# Altium schematic sheet SH6 - LOAD MONITORING 2.SchDoc: Load Monitoring 2
size B; DrawnBy: Farris Matar; Engineer: Farris Matar; Organization: UW Robotics; Address1: 200 University Avenue; Address2: Waterloo; Address3: Ontario; Address4: Canada N2L 3G6; DocumentNumber: 6; Revision: 3; SheetNumber: 6; SheetTotal: 9
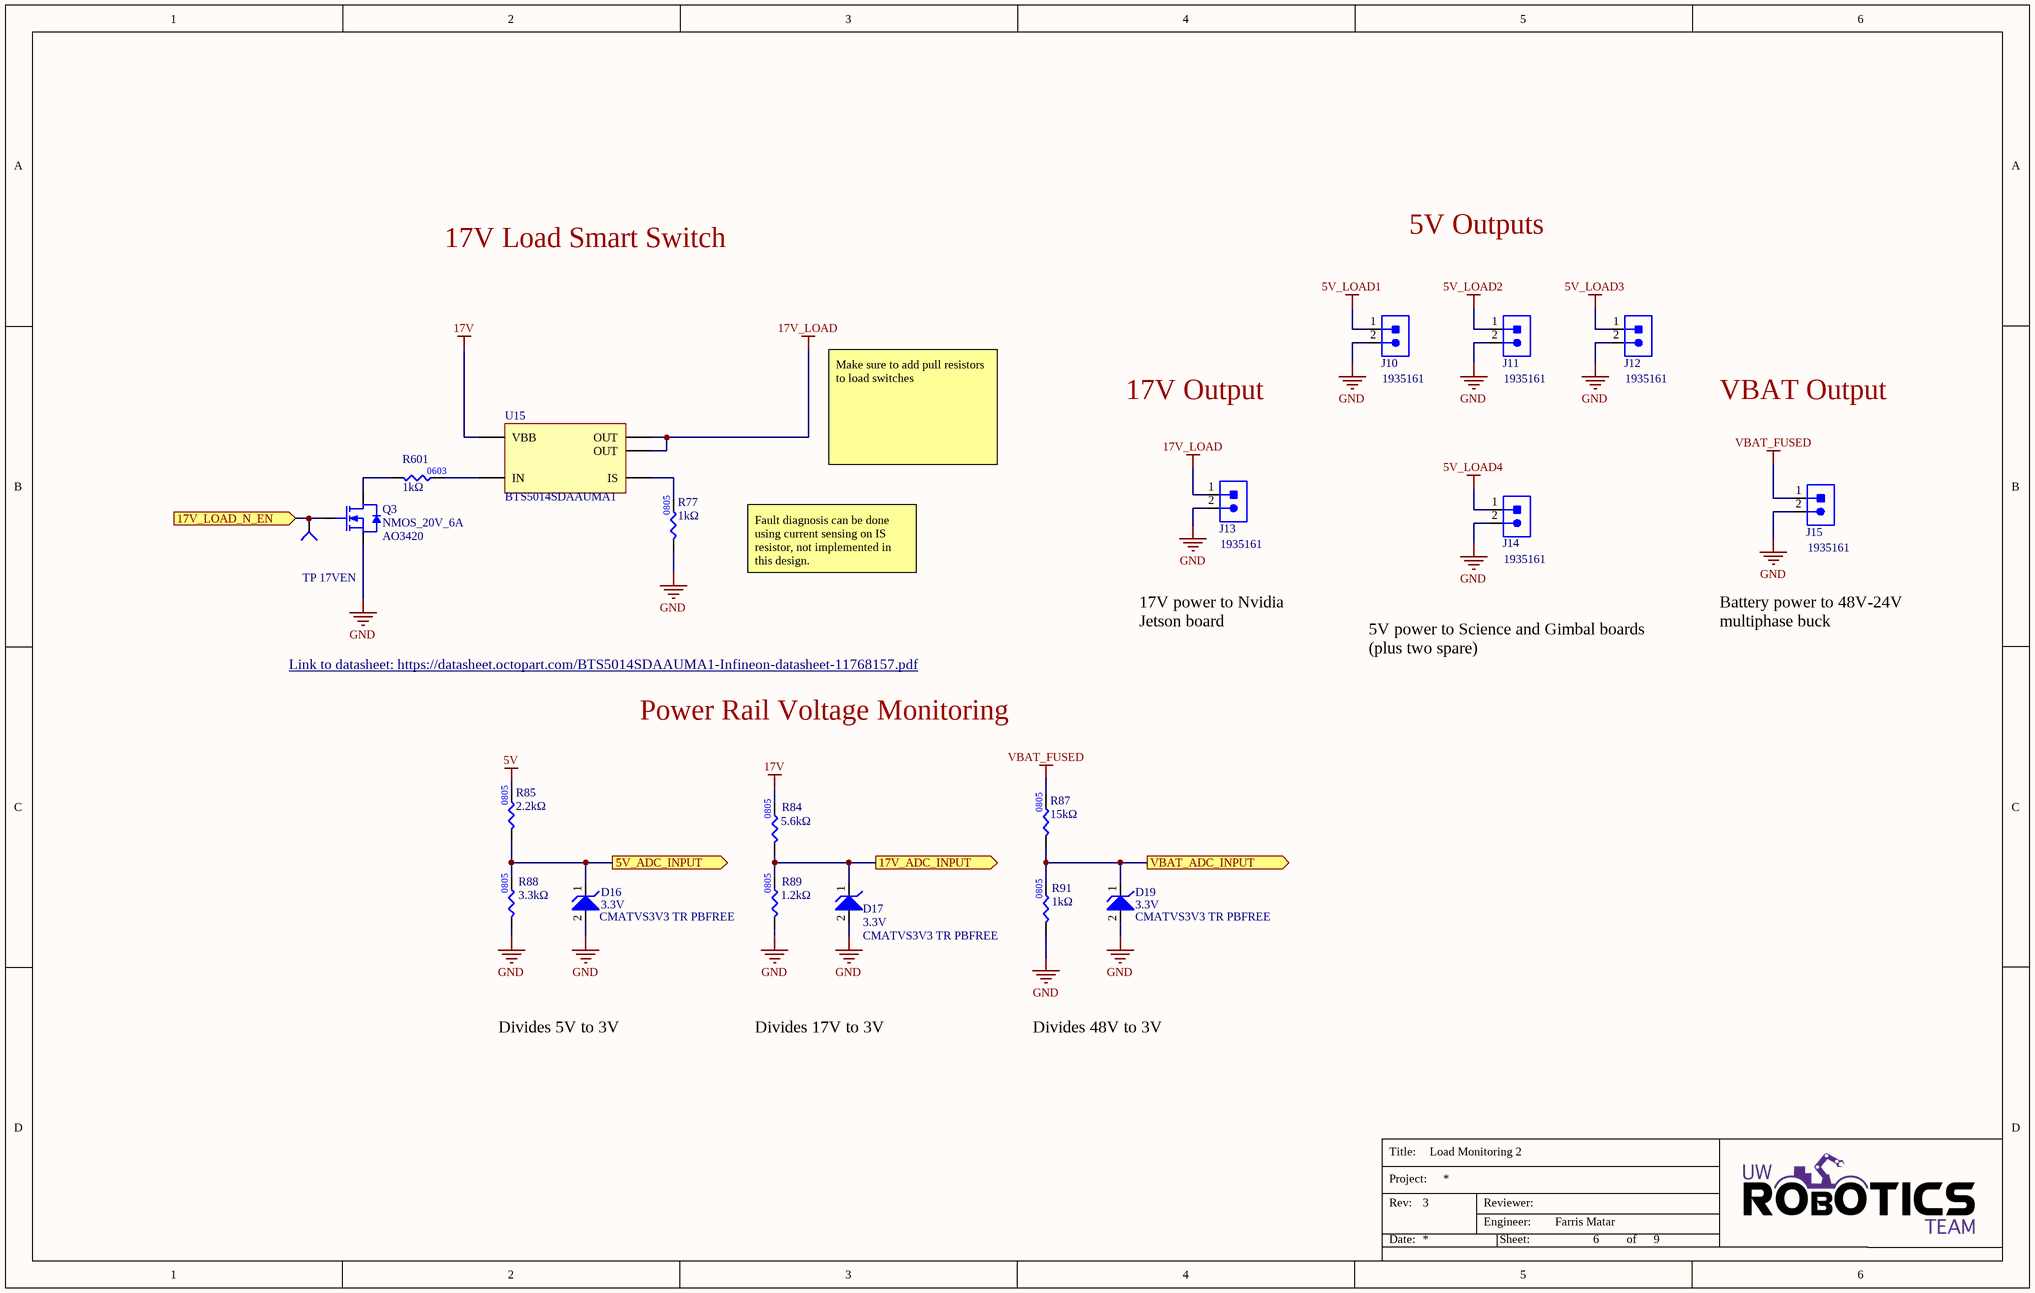
[diagram p0: SH6 - LOAD MONITORING 2.SchDoc]

## Parts
D16  Manufacturer Part Number 1: CMATVS3V3 TR PBFREE  Voltage - Reverse Standoff (Typ): 3.3V  [SOD-923]  (hidden comment: TVS_DIODE_UNIDIR_3.3V_7A)
D17  Manufacturer Part Number 1: CMATVS3V3 TR PBFREE  Voltage - Reverse Standoff (Typ): 3.3V  [SOD-923]  (hidden comment: TVS_DIODE_UNIDIR_3.3V_7A)
D19  Manufacturer Part Number 1: CMATVS3V3 TR PBFREE  Voltage - Reverse Standoff (Typ): 3.3V  [SOD-923]  (hidden comment: TVS_DIODE_UNIDIR_3.3V_7A)
J10  CON_2M_TERM  [1935161]  (value not drawn)
J11  CON_2M_TERM  [1935161]  (value not drawn)
J12  CON_2M_TERM  [1935161]  (value not drawn)
J13  CON_2M_TERM  [1935161]  (value not drawn)
J14  CON_2M_TERM  [1935161]  (value not drawn)
J15  CON_2M_TERM  [1935161]  (value not drawn)
Q3  NMOS_20V_6A  Manufacturer Part Number 1: AO3420  [SOT23-3]
R77  value 1kΩ  [RES0805]  (hidden comment: RES_1kΩ_0805_1%)
R84  value 5.6kΩ  [RES0805]  (hidden comment: RES_5.6kΩ_0805)
R85  value 2.2kΩ  [RES0805]  (hidden comment: RES_2.2kΩ_0805)
R87  value 15kΩ  [RES0805]  (hidden comment: RES_15kΩ_0805_1%)
R88  value 3.3kΩ  [RES0805]  (hidden comment: RES_3.3kΩ_0805_1%)
R89  value 1.2kΩ  [RES0805]  (hidden comment: RES_1.2kΩ_0805)
R91  value 1kΩ  [RES0805]  (hidden comment: RES_1kΩ_0805_1%_1)
R601  value 1kΩ  [RES0603]  (hidden comment: RES_1kΩ_0603_5%)
TP_17VEN  TESTPOINT_1MM_CIRCLE  [TESTPOINT_CIRCLE_1MM]  (value not drawn)  (no BOM)
U15  BTS5014SDAAUMA1  [D2PAK-4]

## Ports
5V_ADC_INPUT (out), 17V_ADC_INPUT (out), 17V_LOAD_N_EN (in), VBAT_ADC_INPUT (out)

## Nets
5V: R85.2
5V_LOAD1: J10.1
5V_LOAD2: J11.1
5V_LOAD3: J12.1
5V_LOAD4: J14.1
17V: R84.2 U15.3(VBB)
17V_LOAD: J13.1 U15.1(OUT) U15.5(OUT)
GND: D16.2 D17.2 D19.2 J10.2 J11.2 J12.2 J13.2 J14.2 J15.2 Q3.2(SOURCE) R77.1 R88.1 R89.1 R91.1
VBAT_FUSED: J15.1 R87.2
5V_ADC_INPUT: D16.1 R85.1 R88.2 ; port 5V_ADC_INPUT
17V_ADC_INPUT: D17.1 R84.1 R89.2 ; port 17V_ADC_INPUT
17V_LOAD_N_EN: Q3.1(GATE) TP_17VEN.1(=value) ; port 17V_LOAD_N_EN
VBAT_ADC_INPUT: D19.1 R87.1 R91.2 ; port VBAT_ADC_INPUT
NetQ3_3: Q3.3(DRAIN) R601.1
NetR77_2: R77.2 U15.4(IS)
NetR601_2: R601.2 U15.2(IN)

## Notes on the sheet
- 5V Outputs
- 17V Load Smart Switch
- 17V Output
- VBAT Output
- Make sure to add pull resistors to load switches
- Fault diagnosis can be done using current sensing on IS resistor, not implemented in this design.
- 17V power to Nvidia Jetson board
- Battery power to 48V-24V multiphase buck
- Link to datasheet: https://datasheet.octopart.com/BTS5014SDAAUMA1-Infineon-datasheet-11768157.pdf <https://datasheet.octopart.com/BTS5014SDAAUMA1-Infineon-datasheet-11768157.pdf>
- 5V power to Science and Gimbal boards (plus two spare)
- Power Rail Voltage Monitoring
- Divides 5V to 3V
- Divides 17V to 3V
- Divides 48V to 3V
- Title:
- Project:
- Date:
- Rev:
- Reviewer:
- Engineer:
- Sheet:
- of
- (in symbol RES_15kΩ_0805_1%) 0805

## Library data of the parts
D16 D17 D19 = TVS_DIODE_UNIDIR_3.3V_7A: TVS DIODE 3.3VWM 11VC SOD923; Manufacturer 1: Central Semiconductor Corp; Voltage - Breakdown (Min): 5V; Voltage - Clamping (Max) @ Ipp: 11V; Mounting Type: SMD; Package/Footprint: SOD-923; Supplier 1: Digi-Key; Supplier Part Number 1: 1514-CMATVS3V3TRPBFREECT-ND; Supplier 2: Mouser; Supplier Part Number 2: 610-CMATVS3V3
J10-J15 = CON_2M_TERM: TERM BLK 2POS SIDE ENTRY 5MM; Manufacturer 1: Phoenix Contact; Max Current Rating: 16A; Current: 18A; Voltage: 300V; Package/Footprint: SMD; Supplier 1: Digi-Key; Supplier Part Number 1: 277-1667-ND; Manufacturer Part Number 1: 1935161; Mounting Type: TH
Q3 = NMOS_20V_6A: MOSFET N-CH 20V 6A SOT-23; Manufacturer 1: Alpha & Omega; Supplier 1: Digi-Key; Supplier Part Number 1: 785-1014-2-ND
R77 = RES_1kΩ_0805_1%: RES 1K OHM 1% 1/8W 0805; Manufacturer 1: Yageo; Manufacturer Part Number 1: RC0805FR-071KL; Supplier 1: Digi-Key; Mounting Type: SMD; Supplier Part Number 1: 311-1.00KCRCT-ND; LCSC Part #: C17513; Package: 0805
R84 = RES_5.6kΩ_0805_5%: RES 5.6K OHM 5% 1/8W 0805; Manufacturer 1: Yageo; Manufacturer Part Number 1: RC0805JR-075K6L; Supplier Part Number 1: 311-5.6KARCT-ND; Supplier 1: Digi-Key; Tolerance: 5%; Package: 0805
R85 = RES_2.2kΩ_0805_5%: RES 2.2K OHM 5% 1/8W 0805; Manufacturer 1: Vishay Dale; Manufacturer Part Number 1: CRCW08052K20JNEAC; Supplier Part Number 1: 541-4169-1-ND; Supplier 1: Digi-Key; Tolerance: 5%; Package: 0805
R87 = RES_15kΩ_0805_1%: RES 15K OHM 1% 1/8W 0805 /; Manufacturer 1: Vishay Dale; Manufacturer Part Number 1: CRCW080515K0FKEA; Supplier Part Number 1: 541-15.0KCCT-ND; Supplier 1: Digi-Key
R88 = RES_3.3kΩ_0805_1%: RES 3.3K OHM 1% 1/8W 0805; Manufacturer 1: Vishay Dale; Manufacturer Part Number 1: CRCW06033K30FKEA; Supplier 1: Digi-Key; Supplier Part Number 1: 541-3.30KHCT-ND; LCSC Part #: C26010; Mounting Type: SMD; Package: 0805
R89 = RES_1.2kΩ_0805_5%: RES 1.2K OHM 5% 1/8W 0805; Manufacturer 1: Yageo; Manufacturer Part Number 1: RC0805JR-071K2L; Supplier 1: Digi-Key; Supplier Part Number 1: 311-1.2KARCT-ND; Tolerance: 5%; Package: 0805
R91 = RES_1kΩ_0805_1%_1: RES 1K OHM 1% 1/8W 0805; Manufacturer 1: Yageo; Manufacturer Part Number 1: RC0805FR-071KL; Supplier 1: Digi-Key; Supplier Part Number 1: 311-1.00KCRCT-ND; Package: 0805; Mounting Type: SMD; LCSC Part #: C17513
R601 = RES_1kΩ_0603_5%: RES 1K OHM 5% 1/10W 0603; Manufacturer 1: Yageo; Manufacturer Part Number 1: RC0603JR-071KL; Supplier Part Number 1: 311-1.0KGRCT-ND; Supplier 1: Digi-Key; Mounting Type: SMD; Package: 0603
TP_17VEN = TESTPOINT_1MM_CIRCLE: TESTPOINT 1MM CIRCLE
U15 = BTS5014SDAAUMA1: IC PWR SWITCH N-CHAN 1:1 TO252-5; Manufacturer 1: Infineon Technologies; Package/Footprint: TO-252-5; Mounting Type: SMD; Manufacturer Part Number 1: BTS5014SDAAUMA1; Supplier 1: Digi-Key; Supplier Part Number 1: BTS5014SDAAUMA1CT-ND; Supplier 2: Mouser; Supplier Part Number 2: 726-BTS5014SDA